# EasyEDA Pro project ProPrj_主板-智能视觉_2026-02-04.epro

# Schematic Schematic1
Board Name: Board1; Create Date: 2026-01-07; Page Name: P1; Project Name: 主板-智能视觉; Schematic Name: Schematic1; Update Date: 2026-02-03; Company: 嘉立创EDA; Page Size: A4; Version: V1.0
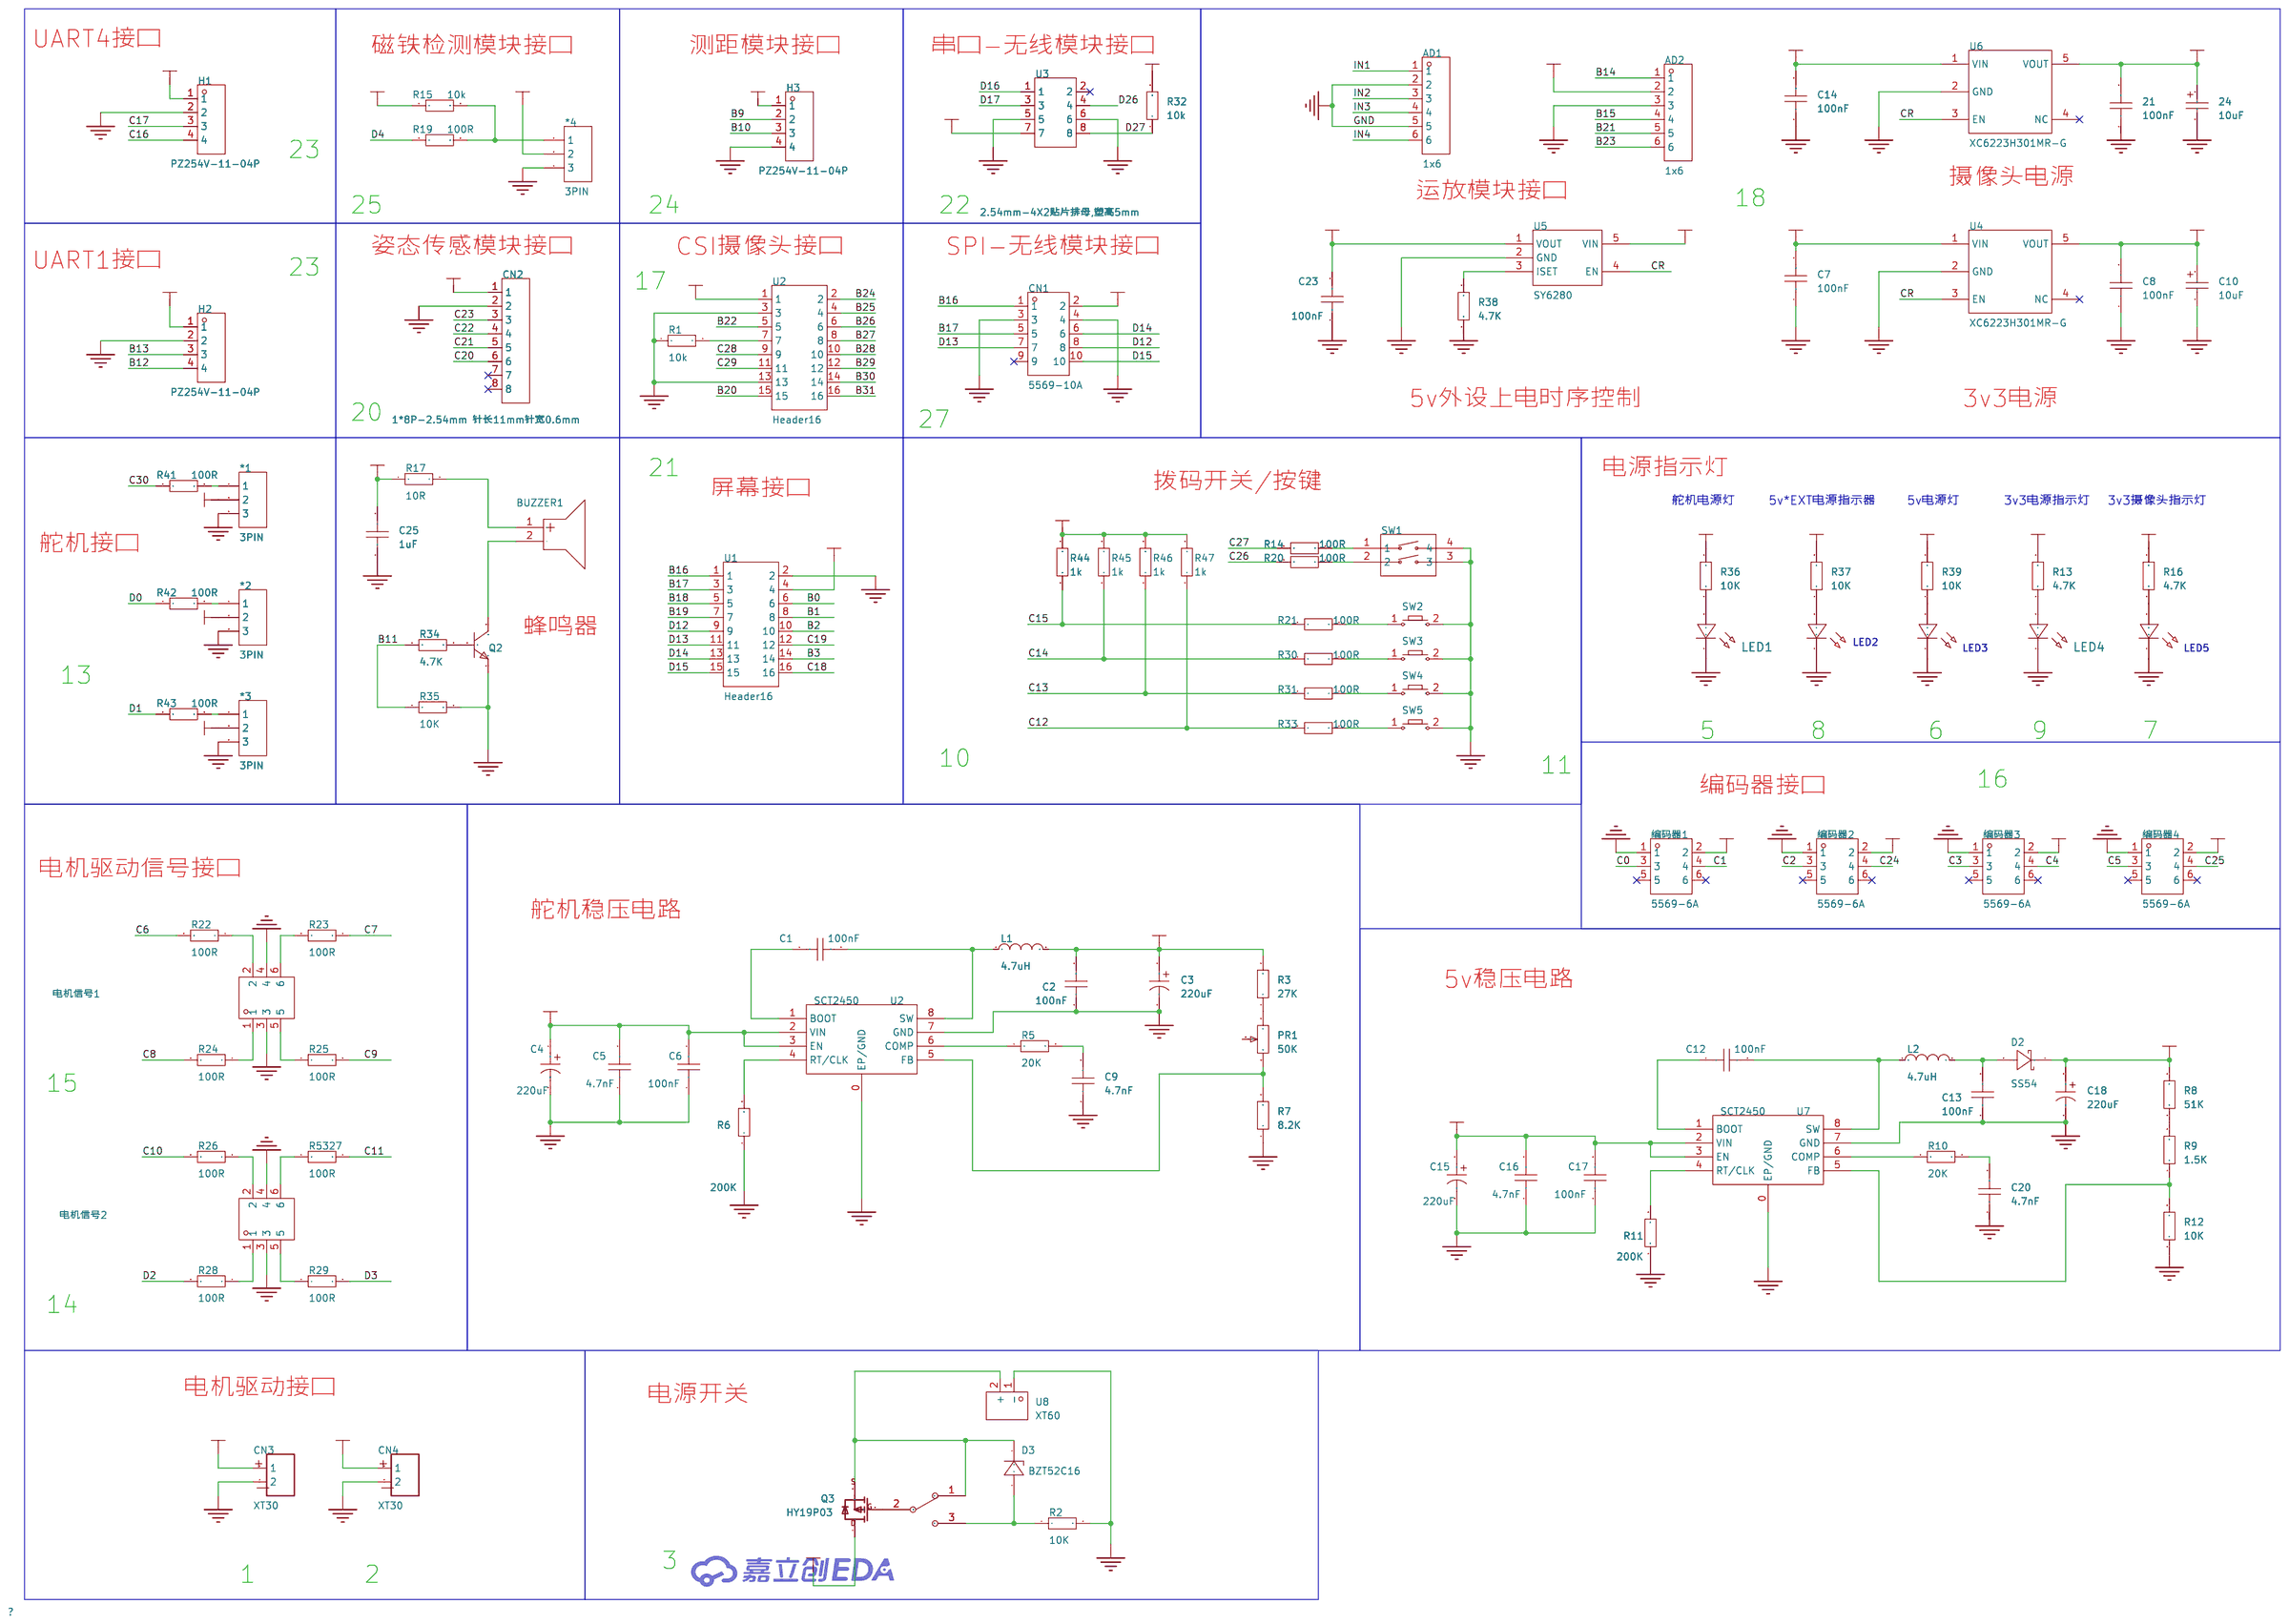
[diagram p0: schematic sheet]

## Parts
21  100nF  [C0603]
24  10uF  [CAP-SMD_L3.2-W1.6-RD-C7171]
*1  3PIN  [3PIN]
*2  3PIN  [3PIN]
*3  3PIN  [3PIN]
*4  3PIN  [3PIN]
AD1  1x6  [HDR-TH_6P-P2.54-V-F]
AD2  1x6  [HDR-TH_6P-P2.54-V-F]
BUZZER1  5V,管脚间距8mm,外径10mm,高9.5mm  [BUZ-TH_BD12.0-P7.60-D0.6-FD]
C1  100nF  [C0603]
C2  100nF  [C1206]
C3  220uF  [CAP-SMD_BD8.0-L8.3-W8.3-LS9.0-FD]
C4  220uF  [CAP-SMD_BD8.0-L8.3-W8.3-LS9.0-FD]
C5  4.7nF  [C1206]
C6  100nF  [C0603]
C7  100nF  [C0603]
C8  100nF  [C0603]
C9  4.7nF  [C0603]
C10  10uF  [CAP-SMD_L3.2-W1.6-RD-C7171]
C12  100nF  [C0603]
C13  100nF  [C1206]
C14  100nF  [C0603]
C15  220uF  [CAP-SMD_BD8.0-L8.3-W8.3-LS9.0-FD]
C16  4.7nF  [C1206]
C17  100nF  [C0603]
C18  220uF  [CAP-SMD_BD8.0-L8.3-W8.3-LS9.0-FD]
C20  4.7nF  [C0603]
C23  100nF  [C0603]
C25  1uF  [C0603]
CN1  5569-10A  [CONN-TH_10P-P4.20_5569-10A]
CN2  1*8P-2.54mm 针长11mm针宽0.6mm  [HDR-TH_8P-P2.54-V-F-S2.54]
CN3  XT30  [XT30 -WS母头]
CN4  XT30  [XT30 -WS母头]
D2  SS54  [SMA_L4.2-W2.6-LS5.1-RD]
D3  BZT52C16  [SOD-123-L]
H1  PZ254V-11-04P  [HDR-TH_4P-P2.54-V-M]
H2  PZ254V-11-04P  [HDR-TH_4P-P2.54-V-M]
H3  PZ254V-11-04P  [HDR-TH_4P-P2.54-V-M]
L1  4.7uH  [IND-SMD_L7.1-W6.6_POHS0603]
L2  4.7uH  [IND-SMD_L7.1-W6.6_POHS0603]
LED1  -  [LED_0603]
LED2  -  [LED_0603]
LED3  -  [LED_0603]
LED4  -  [LED_0603]
LED5  -  [LED_0603]
PR1  50K  [R_3386P]
Q2  -  [S8050_TO_92]
Q3  HY19P03  [TO-252AA]
R1  10k  [R0603]
R2  10K  [R0603]
R3  27K  [R0603]
R5  20K  [R0603]
R6  200K  [R0603]
R7  8.2K  [R0603]
R8  51K  [R0603]
R9  1.5K  [R0603]
R10  20K  [R0603]
R11  200K  [R0603]
R12  10K  [R0603]
R13  4.7K  [R0603]
R14  100Ω ±1% 62.5mW  [R0402]
R15  10k  [R0603]
R16  4.7K  [R0603]
R17  10R  [R0603]
R19  100Ω ±1% 62.5mW  [R0402]
R20  100Ω ±1% 62.5mW  [R0402]
R21  100Ω ±1% 62.5mW  [R0402]
R22  100Ω ±1% 62.5mW  [R0402]
R23  100Ω ±1% 62.5mW  [R0402]
R24  100Ω ±1% 62.5mW  [R0402]
R25  100Ω ±1% 62.5mW  [R0402]
R26  100Ω ±1% 62.5mW  [R0402]
R28  100Ω ±1% 62.5mW  [R0402]
R29  100Ω ±1% 62.5mW  [R0402]
R30  100Ω ±1% 62.5mW  [R0402]
R31  100Ω ±1% 62.5mW  [R0402]
R32  10k  [R0603]
R33  100Ω ±1% 62.5mW  [R0402]
R34  4.7K  [R0603]
R35  10K  [R0603]
R36  10K  [R0603]
R37  10K  [R0603]
R38  4.7K  [R0603]
R39  10K  [R0603]
R41  100Ω ±1% 62.5mW  [R0402]
R42  100Ω ±1% 62.5mW  [R0402]
R43  100Ω ±1% 62.5mW  [R0402]
R44  1k  [R0603]
R45  1k  [R0603]
R46  1k  [R0603]
R47  1k  [R0603]
R5327  100Ω ±1% 62.5mW  [R0402]
SW1  CES-0202MC  [SW-TH_NIDEC_CES-0202MC]
SW2  -  [Key_SMD_3x4x2]
SW3  -  [Key_SMD_3x4x2]
SW4  -  [Key_SMD_3x4x2]
SW5  -  [Key_SMD_3x4x2]
SW6  拨码开关  [3PIN2档拨动开关]
U1  Header16  [CONN-TH_16P-P2.50_C9900044747]
U2  Header16  [CONN-TH_16P-P2.50_C9900044747]
U2#2  SCT2450  [SOP-8E]
U3  2.54mm-4X2贴片排母,塑高5mm  [HDR-SMD_8P-P2.54-V-F-R2-C4-S7.1]
U4  XC6223H301MR-G
U5  SY6280  [SOT-23-5]
U6  XC6223H301MR-G
U7  SCT2450  [SOP-8E]
U8  XT60  [CONN-TH_XT60]
电机信号1  5569-6A  [CONN-TH_6P-P4.20_5569-6A-1]
电机信号2  5569-6A  [CONN-TH_6P-P4.20_5569-6A-1]
编码器1  5569-6A  [CONN-TH_6P-P4.20_5569-6A-1]
编码器2  5569-6A  [CONN-TH_6P-P4.20_5569-6A-1]
编码器3  5569-6A  [CONN-TH_6P-P4.20_5569-6A-1]
编码器4  5569-6A  [CONN-TH_6P-P4.20_5569-6A-1]

## Library data of the parts
21 C1 C6-C9 C12 C14 C17 C20 C23 C25 = CAP_0603: Supplier Footprint: 0603
24 C10 = TAJA106K016RNJ: 容值:10uF;精度:±10%;额定电压:16V;等效串联电阻(ESR):3Ω@100kHz;; LCSC Part Name: 10uF ±10% 16V; Supplier Part: C7171; Manufacturer: Kyocera AVX; Supplier Footprint: CASE-A-3216-18(mm); JLCPCB Part Class: 基础库; Supplier: LCSC; Tolerance: ±10%; Voltage Rating: 16V; Equivalent Series Resistance(ESR): 3Ω@100kHz; Operating Temperature: -55℃~+125℃
*1-*4 = 3PIN: Origin Footprint 2: 1*3PIN; Origin Footprint 4: 1*3PIN; Origin Footprint 5: 1*3PIN
AD1 AD2 = 1x6: Supplier: LCSC; Manufacturer: BOOMELE; Manufacturer Part: Female header 1*6p; Supplier Part: C40877; JLCPCB Part Class: Extended Part
BUZZER1 = 5V,管脚间距8mm,外径10mm,高9.5mm: Supplier Part: C9900017013; Supplier Footprint: BEEP; JLCPCB Part Class: 扩展库; Supplier: LCSC
C2 C5 C13 C16 = CAP_1206: Supplier Footprint: 1206
C3 C4 C15 C18 = RYRVT25V220UF8*10: 容值:220uF;精度:±20%;额定电压:25V;纹波电流:183mA@120Hz;; LCSC Part Name: 220uF ±20% 25V; Supplier Part: C48970746; Manufacturer: HONOR(荣誉); Supplier Footprint: SMD,D8xL10.2mm; JLCPCB Part Class: 扩展库; Datasheet: https://item.szlcsc.com/datasheet/RYRVT25V220UF8*10/51295690.html; Supplier: LCSC; Tolerance: ±20%; Voltage Rating: 25V; Ripple Current: 183mA@120Hz; Diameter: 8mm; Height - Seated (Max): 10.2mm; Lifetime: 2000hrs@105℃; Operating Temperature: -55℃~+105℃
CN1 = 5569-10A: Supplier Part: C9900070524; Supplier Footprint: 2*5p; JLCPCB Part Class: Extended Part; Supplier: LCSC
CN2 = 1*8P-2.54mm 针长11mm针宽0.6mm: Supplier Part: C9900024110; Supplier Footprint: 1*8P-2.54mm; JLCPCB Part Class: 扩展库; Supplier: LCSC
CN3 CN4 = XT30: Supplier: LCSC; Supplier Part: C108769; Manufacturer: Changzhou Amass Elec; Manufacturer Part: XT30UPB-F; nameAlias: Value; Contributor: LCSC; spicePre: C; spiceSymbolName: XT30UPB-F; Origin Footprint 2: XT30 -ls公头; Origin Footprint 3: XT30 -WS公头; Origin Footprint 4: XT30 -LS母头
D2 = SS54: Supplier Part: C9900023219; Supplier Footprint: (1N5824)DO-214; JLCPCB Part Class: 扩展库; Supplier: LCSC
D3 = BZT52C16: Published: 8-Jun-2000; Revision: July-2002: Re-released for DXP Platform.; Publisher: Altium Limited; Price(RMB): 0.000; Origin Footprint 2: DIODE-0.7; Origin Footprint 3: DIODE-0.4; Origin Footprint 4: SOD-87[LL-41]; Origin Footprint 5: CD4521-1808; Origin Footprint 6: SOD-80[LL-34]; Origin Footprint 7: SOD-123-FL; Origin Footprint 8: SOD-123-M; Origin Footprint 9: SOD-323; Origin Footprint 10: SOD-523-L; Origin Footprint 11: SOD-523-M
H1-H3 = PZ254V-11-04P: 插针结构:1x4P;间距:2.54mm;行距:-;圆针/方针:方针;安装方式:直插;排数:单排;总PIN位数:4P;额定电流:3A;额定电压:250V;配合针长度:6mm;塑高:2.5mm;端接针长度:3mm;触头材质:-;工作温度:-40℃~+105℃;颜色:黑色;; LCSC Part Name: 1x4P 间距:2.54mm 方针 直插; Supplier Part: C2691448; Manufacturer: XFCN(兴飞); Supplier Footprint: 插件,P=2.54mm; JLCPCB Part Class: 扩展库; Datasheet: https://item.szlcsc.com/datasheet/PZ254V-11-04P/2801085.html; Supplier: LCSC; Pin Structure: 1x4P; Pitch: 2.54mm; Circluar Pins/Square Pins: 方针; Mounting Type: 直插; Number of Rows: 单排; Number of Pins: 4P; Current Rating: 3A; Voltage Rating (Max): 250V; Length of Mating Pin: 6mm; Insulation Height: 2.5mm; Length of End Connection Pin: 3mm; Operating Temperature: -40℃~+105℃; Color: 黑色
L1 L2 = POHS0603-4R7M: 电感值:4.7uH;精度:±20%;额定电流:5A;饱和电流(Isat):8A;类型:一体成型电感;; LCSC Part Name: 功率电感; Supplier Part: C49333010; Manufacturer: HYHONGYEX(宏业); Supplier Footprint: SMD,7.1x6.6mm; JLCPCB Part Class: 扩展库; Datasheet: https://item.szlcsc.com/datasheet/POHS0603-4R7M/51817416.html; Supplier: LCSC; Tolerance: ±20%; Current Rating: 5A; Current - Saturation(Isat): 8A; DC Resistance(DCR): 40mΩ; Type: 一体成型电感
LED1 LED4 = LED_0603-R: Supplier Footprint: 0603
LED2 LED5 = LED_0603-G: Supplier Footprint: 0603
LED3 = LED_0603-B: Supplier Footprint: 0603
PR1 = R_3386P: Supplier Footprint: 直插
Q2 = S8050_TO_NPN: Supplier Footprint: TO-92
Q3 = HY19P03: HY19P03 P-Channel MOSFET; componentDisplayMode: -1
R1 R15 R32 R44-R47 = R-10K-1%: 电阻类型:厚膜电阻;阻值:10kΩ;精度:±1%;功率:100mW;工作电压:75V;温度系数:±100ppm/℃;; Manufacturer: UNI-ROYAL(厚声); Manufacturer Part: 0603WAF1002T5E; Supplier: LCSC; Supplier Part: C25804; LCSC Part Name: 厚膜电阻 10kΩ ±1% 100mW; Supplier Footprint: 0603; JLCPCB Part Class: Basic Part; Datasheet: https://atta.szlcsc.com/upload/public/pdf/source/20200306/C422600_1E6D84923E4A46A82E41ADD87F860B5C.pdf; Type: 厚膜电阻; Tolerance: ±1%; Power(Watts): 100mW; Voltage-Supply(Max): 75V; Temperature Coefficient: ±100ppm/℃; Operating Temperature: -55℃~+155℃
R2 R3 R5-R13 R16 R17 R34-R39 = Res_0603: Supplier Footprint: 0603
R14 R19-R26 R28-R31 R33 R41-R43 R5327 = 100Ω ±1% 62.5mW R0402: LCSC Part Name: 100Ω(1000) ±1% 编带; Supplier Part: C25076; Manufacturer: UNI-ROYAL(厚声); Manufacturer Part: 0402WGF1000TCE; Supplier Footprint: 0402; JLCPCB Part Class: Basic Part; Datasheet: https://atta.szlcsc.com/upload/public/pdf/source/20170920/C25076_1505901197574982707.pdf; Supplier: LCSC; ERP编码: 000
SW1 = CES-0202MC: 特性：双镀金触点,接触稳定性极佳。符合RoHS标准。触感清脆。应用：热水设备。空调设备; LCSC Part Name: 拨码开关 (间距2.54mm); Supplier Part: C2921546; Manufacturer: NIDEC(尼得科); Supplier Footprint: 插件,P=2.54mm; JLCPCB Part Class: 扩展库; Datasheet: https://item.szlcsc.com/datasheet/CES-0202MC/3230398.html; Supplier: LCSC
SW2-SW5 = Key_SMD_3x4x2: Supplier Footprint: SMD
SW6 = 拨码开关: Origin Footprint 1: TA-3524S-A2
U1 U2 = Header16_C9900044747: Supplier Part: C9900044747; Supplier Footprint: TH-2*8P-2.54; JLCPCB Part Class: 扩展库; Supplier: LCSC
U2#2 U7 = SCT2450
U3 = 2.54mm-4X2贴片排母,塑高5mm: Supplier Part: C9900015268; Supplier Footprint: BDM_SMD2.54-2*4; JLCPCB Part Class: 扩展库; Supplier: LCSC
U4 U6 = RT9013: 存货编码: 1110404156; 存货名称: 集成电路
U5 = SY6280: Published: 2020-12-08; Revision: V1.0; Imax: 2.1A
U8 = XT60: 模型锂电连接器; LCSC Part Name: XT60公头（电调端）; Supplier Part: C98733; Manufacturer: AMASS(艾迈斯); Supplier Footprint: XT60-M; JLCPCB Part Class: Extended Part; Datasheet: https://atta.szlcsc.com/upload/public/pdf/source/20170606/1496716524919.pdf; Supplier: LCSC
电机信号1 电机信号2 编码器1-编码器4 = 5569-6A: Supplier Part: C9900070523; Supplier Footprint: 2*3p; JLCPCB Part Class: Extended Part; Supplier: LCSC

## Nets
3V3: 21.2 24.1 *4.2 AD2.2 C8.2 C10.1 C25.2 CN2.1 H3.1 R13.2 R15.1 R17.1 R32.2 R44.2 R45.2 R46.2 R47.2 U1.4 U4.5(VOUT) U6.5(VOUT) 编码器1.2 编码器2.2 编码器3.2 编码器4.2
GND: 21.1 24.2 *1.3 *2.3 *3.3 *4.3 AD1.2 AD1.5 AD2.3 C2.1 C3.2 C4.2 C5.1 C6.1 C7.1 C8.1 C9.1 C10.2 C13.1 C14.1 C15.2 C16.1 C17.1 C18.2 C20.1 C23.1 C25.1 CN1.3 CN1.4 CN2.2 CN3.2 CN4.2 H1.2 H2.2 H3.4 LED1.1(C) LED2.1(C) LED3.1(C) LED4.1(C) LED5.1(C) Q2.1(E) R1.1 R2.2 R6.1 R7.1 R11.1 R12.1 R35.2 R38.1 SW1.3 SW1.4 SW2.2 SW3.2 SW4.2 SW5.2 U1.2 U2.3 U2.13 U2#2.0(EP/GND) U2#2.7(GND) U3.5 U3.6 U4.2(GND) U5.2(GND) U6.2(GND) U7.0(EP/GND) U7.7(GND) U8.1(-) 电机信号1.3 电机信号1.4 电机信号2.3 电机信号2.4 编码器1.1 编码器2.1 编码器3.1 编码器4.1
VCC-5V: C18.1 D2.1(C) R8.2 R39.2 U5.5(VIN)
VCC-5V-EXT: C23.2 CN1.2 H1.1 H2.1 R37.2 U3.7 U5.1(VOUT)
VCC_5V: C7.2 C14.2 U4.1(VIN) U6.1(VIN)
VCC_SERVO: *1.2 *2.2 *3.2 C2.2 C3.1 L1.2 R3.2 R36.2
VCCBAT: C4.1 C5.2 C6.2 C15.1 C16.2 C17.2 CN3.1 CN4.1 Q3.1(D) U2#2.2(VIN) U2#2.3(EN) U7.2(VIN) U7.3(EN)
B0: U1.6
B1: U1.8
B2: U1.10
B3: U1.14
B9: H3.2
B10: H3.3
B11: R34.1 R35.1
B12: H2.4
B13: H2.3
B14: AD2.1
B15: AD2.4
B16: CN1.1 U1.1
B17: CN1.5 U1.3
B18: U1.5
B19: U1.7
B20: U2.15
B21: AD2.5
B22: U2.5
B23: AD2.6
B24: U2.2
B25: U2.4
B26: U2.6
B27: U2.8
B28: U2.10
B29: U2.12
B30: U2.14
B31: U2.16
C0: 编码器1.3
C1: 编码器1.4
C2: 编码器2.3
C3: 编码器3.3
C4: 编码器3.4
C5: 编码器4.3
C6: R22.2
C7: R23.1
C8: R24.2
C9: R25.2
C10: R26.2
C11: R5327.1
C12: R33.2 R47.1
C13: R31.2 R46.1
C14: R30.2 R45.1
C15: R21.2 R44.1
C16: H1.4
C17: H1.3
C18: U1.16
C19: U1.12
C20: CN2.6
C21: CN2.5
C22: CN2.4
C23: CN2.3
C24: 编码器2.4
C25: 编码器4.4
C26: R20.2
C27: R14.2
C28: U2.9
C29: U2.11
C30: R41.1
CR: U4.3(EN) U5.4(EN) U6.3(EN)
CSI-3V3: R16.2 U2.1
D0: R42.1
D1: R43.1
D2: R28.2
D3: R29.2
D4: R19.1
D12: CN1.8 U1.9
D13: CN1.7 U1.11
D14: CN1.6 U1.13
D15: CN1.10 U1.15
D16: U3.1
D17: U3.3
D26: U3.4
D27: R32.1 U3.8
IN1: AD1.1
IN2: AD1.3
IN3: AD1.4
IN4: AD1.6
Net-(*1-1): *1.1 R41.2
Net-(*2-1): *2.1 R42.2
Net-(*3-1): *3.1 R43.2
Net-(*4-1): *4.1 R15.2 R19.2
Net-(BUZZER1-1): BUZZER1.1(+) R17.2
Net-(BUZZER1-2): BUZZER1.2(-) Q2.3(C)
Net-(C1-1): C1.1 U2#2.1(BOOT)
Net-(C1-2): C1.2 L1.1 U2#2.8(SW)
Net-(C9-2): C9.2 R5.2
Net-(C12-1): C12.1 U7.1(BOOT)
Net-(C12-2): C12.2 L2.1 U7.8(SW)
Net-(C13-2): C13.2 D2.2(A) L2.2
Net-(C20-2): C20.2 R10.2
Net-(D3-A): D3.A R2.1 SW6.3
Net-(D3-K): D3.K Q3.3(S) SW6.1 U8.2(+)
Net-(LED1-2): LED1.2(A) R36.1
Net-(LED2-2): LED2.2(A) R37.1
Net-(LED3-2): LED3.2(A) R39.1
Net-(LED4-2): LED4.2(A) R13.1
Net-(LED5-2): LED5.2(A) R16.1
Net-(PR1-1): PR1.1 R3.1
Net-(PR1-3): PR1.3 R7.2 U2#2.5(FB)
Net-(Q2-2): Q2.2(B) R34.2
Net-(Q3-2): Q3.2(G) SW6.2
Net-(R1-2): R1.2 U2.7
Net-(R5-1): R5.1 U2#2.6(COMP)
Net-(R6-2): R6.2 U2#2.4(RT/CLK)
Net-(R8-1): R8.1 R9.2
Net-(R9-1): R9.1 R12.2 U7.5(FB)
Net-(R10-1): R10.1 U7.6(COMP)
Net-(R11-2): R11.2 U7.4(RT/CLK)
Net-(R14-1): R14.1 SW1.1
Net-(R20-1): R20.1 SW1.2
Net-(R21-1): R21.1 SW2.1
Net-(R22-1): R22.1 电机信号1.2
Net-(R23-2): R23.2 电机信号1.6
Net-(R24-1): R24.1 电机信号1.1
Net-(R25-1): R25.1 电机信号1.5
Net-(R26-1): R26.1 电机信号2.2
Net-(R28-1): R28.1 电机信号2.1
Net-(R29-1): R29.1 电机信号2.5
Net-(R30-1): R30.1 SW3.1
Net-(R31-1): R31.1 SW4.1
Net-(R33-1): R33.1 SW5.1
Net-(R38-2): R38.2 U5.3(ISET)
Net-(R5327-2): R5327.2 电机信号2.6

Not connected (* = marked no-connect by the designer): CN1 9*; CN2 7* 8*; PR1 2; U3 2*; U4 4(NC)*; U6 4(NC)*; 编码器1 5* 6*; 编码器2 5* 6*; 编码器3 5* 6*; 编码器4 5* 6*

## Notes on the sheet
- UART4接口
- 磁铁检测模块接口
- 测距模块接口
- 串口-无线模块接口
- 23
- 摄像头电源
- 运放模块接口
- 18
- 25
- 24
- 22
- 姿态传感模块接口
- CSI摄像头接口
- SPI-无线模块接口
- UART1接口
- 23
- 17
- 20
- 5v外设上电时序控制
- 3v3电源
- 27
- 21
- 电源指示灯
- 屏幕接口
- 拨码开关/按键
- 舵机电源灯
- 5v*EXT电源指示器
- 5v电源灯
- 3v3电源指示灯
- 3v3摄像头指示灯
- 舵机接口
- 蜂鸣器
- 13
- 5
- 8
- 6
- 9
- 7
- 10
- 11
- 编码器接口
- 16
- 电机驱动信号接口
- 舵机稳压电路
- 5v稳压电路
- 15
- 14
- 电机驱动接口
- 电源开关
- 3
- 1
- 2
